# Altium project DO_AN2.PrjPCB
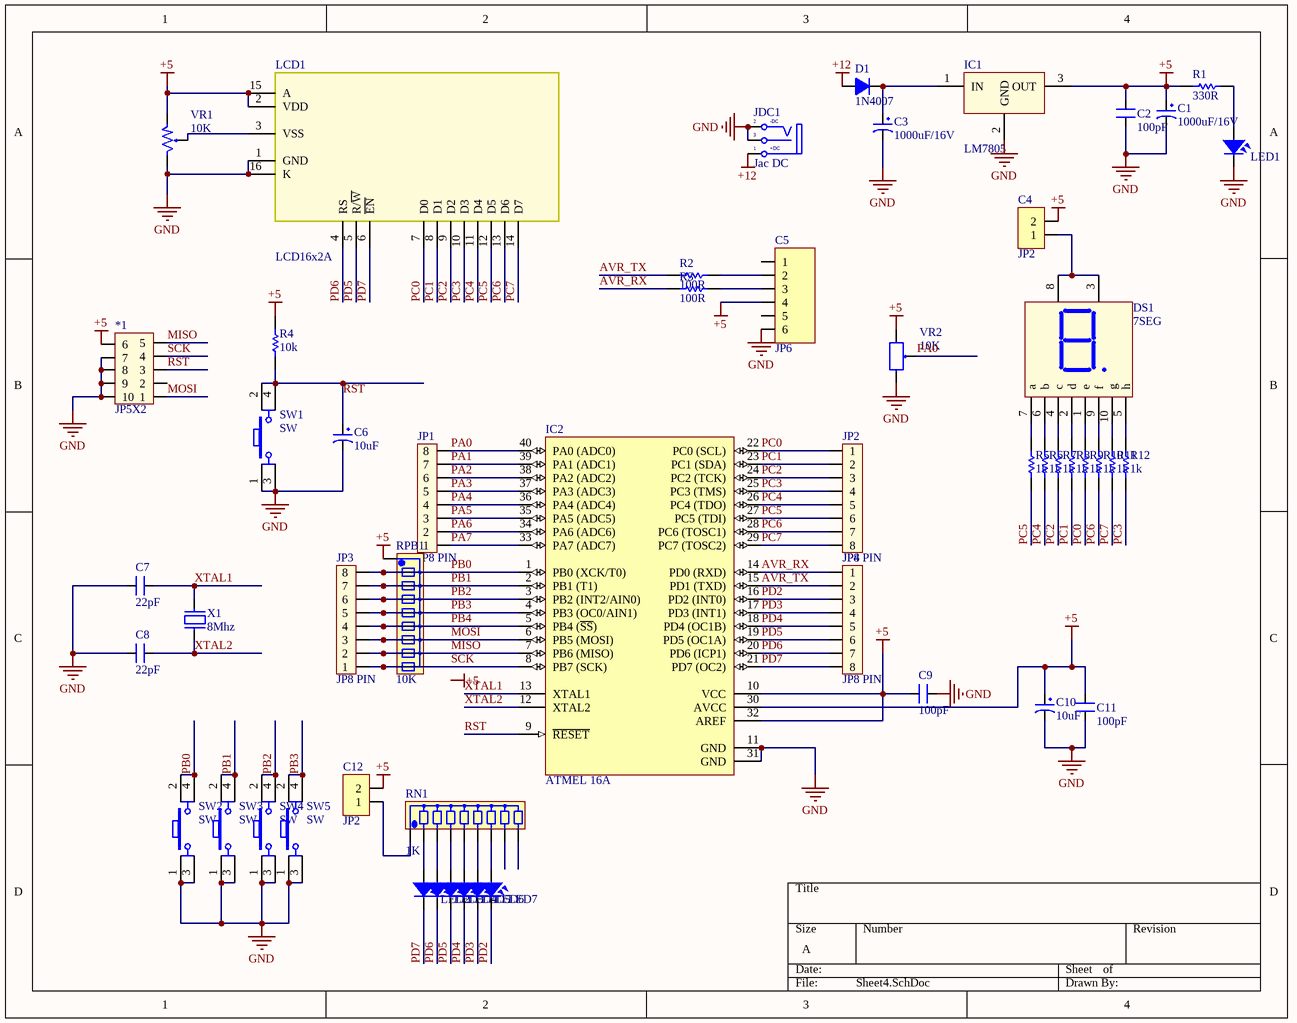
[diagram p0: Sheet4.SchDoc]
1 sheet, 52 parts. Net scope: global (net labels, ports and power ports of the same name join across sheets).
Board file: PCB5.PcbDoc

## Sheet Sheet4.SchDoc
size A

### Parts
*1  JP5X2  [JP5X2]
C1  1000uF/16V  [CP1.5/3.4]
C2  100pF  [CN1]
C3  1000uF/16V  [CP1.5/3.4]
C4  JP2  [JP2-D1T]
C5  JP6  [JP6-D1T]
C6  10uF  [CP1/2]
C7  22pF  [CN1]
C8  22pF  [CN1]
C9  100pF  [CN1]
C10  10uF  [CP1/2]
C11  100pF  [CN1]
C12  JP2  [JP2-D1T]
D1  1N4007  [D1A]
DS1  7SEG  [LED7SEG-1-0.56]
IC1  LM7805  [QTO-220]
IC2  ATMEL 16A  [DIP40/W0.6]
JDC1  Jac DC  [DC-IN]
JP1  JP8 PIN  [JP8]
JP2  JP8 PIN  [JP8]
JP3  JP8 PIN  [JP8]
JP4  JP8 PIN  [JP8]
LCD1  LCD16x2A  [LCD16X2]
LED1  LED  [LED-5-RED]  (value not drawn)
LED2  LED  [LED-3]  (value not drawn)
LED3  LED  [LED-3]  (value not drawn)
LED4  LED  [LED-3]  (value not drawn)
LED5  LED  [LED-3]  (value not drawn)
LED6  LED  [LED-3]  (value not drawn)
LED7  LED  [LED-3]  (value not drawn)
R1  value 330R  [R1/4W]  (hidden comment: Res1)
R2  value 100R  [R1/4W]  (hidden comment: Res1)
R3  value 100R  [R1/4W]  (hidden comment: Res1)
R4  value 10k  [R1/4W]  (hidden comment: Res1)
R5  value 1k  [R1/4W]  (hidden comment: Res1)
R6  value 1k  [R1/4W]  (hidden comment: Res1)
R7  value 1k  [R1/4W]  (hidden comment: Res1)
R8  value 1k  [R1/4W]  (hidden comment: Res1)
R9  value 1k  [R1/4W]  (hidden comment: Res1)
R10  value 1k  [R1/4W]  (hidden comment: Res1)
R11  value 1k  [R1/4W]  (hidden comment: Res1)
R12  value 1k  [R1/4W]  (hidden comment: Res1)
RN1  1K  [RN8]
RPB1  10K  [RN8]
SW1  SW  [SW4]
SW2  SW  [SW4]
SW3  SW  [SW4]
SW4  SW  [SW4]
SW5  SW  [SW4]
VR1  10K  [VR]
VR2  10K  [VR1]
X1  8Mhz  [XT2]

### Nets
+5: *1.6 C1.1 C2.1 C4.2 C5.4 C9.1 C10.1 C11.2 C12.2 IC1.3(OUT) IC2.10(VCC) IC2.30(AVCC) IC2.32(AREF) LCD1.2(VDD) LCD1.15(A) R1.2 R4.1 RPB1.1 VR1.1 VR2.1
+12: D1.1(A) JDC1.1(T)
GND: *1.7 *1.8 *1.9 *1.10 C1.2 C2.2 C3.2 C5.6 C6.2 C7.1 C8.1 C9.2 C10.2 C11.1 IC1.2(GND) IC2.11(GND) IC2.31(GND) JDC1.2(TN) JDC1.3(S) LCD1.1(GND) LCD1.16(K) LED1.2 SW1.1 SW1.3 SW2.1 SW2.3 SW3.1 SW3.3 SW4.1 SW4.3 SW5.1 SW5.3 VR1.3 VR2.3
AVR_RX: IC2.14(PD0_(RXD)) JP4.1 R3.2
AVR_TX: IC2.15(PD1_(TXD)) JP4.2 R2.2
MISO: *1.5 IC2.7(PB6_(MISO)) JP3.2 RPB1.8
MOSI: *1.1 IC2.6(PB5_(MOSI)) JP3.3 RPB1.7
PA0: IC2.40(PA0_(ADC0)) JP1.8 VR2.2
PA1: IC2.39(PA1_(ADC1)) JP1.7
PA2: IC2.38(PA2_(ADC2)) JP1.6
PA3: IC2.37(PA3_(ADC3)) JP1.5
PA4: IC2.36(PA4_(ADC4)) JP1.4
PA5: IC2.35(PA5_(ADC5)) JP1.3
PA6: IC2.34(PA6_(ADC6)) JP1.2
PA7: IC2.33(PA7_(ADC7)) JP1.1
PB0: IC2.1(PB0_(XCK/T0)) JP3.8 RPB1.2 SW2.2 SW2.4
PB1: IC2.2(PB1_(T1)) JP3.7 RPB1.3 SW3.2 SW3.4
PB2: IC2.3(PB2_(INT2/AIN0)) JP3.6 RPB1.4 SW4.2 SW4.4
PB3: IC2.4(PB3_(OC0/AIN1)) JP3.5 RPB1.5 SW5.2 SW5.4
PB4: IC2.5(PB4_(~{SS})) JP3.4 RPB1.6
PC0: IC2.22(PC0_(SCL)) JP2.1 LCD1.7(D0) R9.2
PC1: IC2.23(PC1_(SDA)) JP2.2 LCD1.8(D1) R8.2
PC2: IC2.24(PC2_(TCK)) JP2.3 LCD1.9(D2) R7.2
PC3: IC2.25(PC3_(TMS)) JP2.4 LCD1.10(D3) R12.2
PC4: IC2.26(PC4_(TDO)) JP2.5 LCD1.11(D4) R6.2
PC5: IC2.27(PC5_(TDI)) JP2.6 LCD1.12(D5) R5.2
PC6: IC2.28(PC6_(TOSC1)) JP2.7 LCD1.13(D6) R10.2
PC7: IC2.29(PC7_(TOSC2)) JP2.8 LCD1.14(D7) R11.2
PD2: IC2.16(PD2_(INT0)) JP4.3 LED7.2
PD3: IC2.17(PD3_(INT1)) JP4.4 LED6.2
PD4: IC2.18(PD4_(OC1B)) JP4.5 LED5.2
PD5: IC2.19(PD5_(OC1A)) JP4.6 LCD1.5(R/~{W}) LED4.2
PD6: IC2.20(PD6_(ICP1)) JP4.7 LCD1.4(RS) LED3.2
PD7: IC2.21(PD7_(OC2)) JP4.8 LCD1.6(~{EN}) LED2.2
RST: *1.3 C6.1 IC2.9(~{RESET}) R4.2 SW1.2 SW1.4
SCK: *1.4 IC2.8(PB7_(SCK)) JP3.1 RPB1.9
XTAL1: C7.2 IC2.13(XTAL1) X1.2
XTAL2: C8.2 IC2.12(XTAL2) X1.1
NetC3_1: C3.1 D1.2(K) IC1.1(IN)
NetC4_1: C4.1 DS1.3(Vcc) DS1.8(Vcc)
NetC5_2: C5.2 R2.1
NetC5_3: C5.3 R3.1
NetC12_1: C12.1 RN1.1
NetDS1_1: DS1.1(e) R9.1
NetDS1_2: DS1.2(d) R8.1
NetDS1_4: DS1.4(c) R7.1
NetDS1_5: DS1.5(h) R12.1
NetDS1_6: DS1.6(b) R6.1
NetDS1_7: DS1.7(a) R5.1
NetDS1_9: DS1.9(f) R10.1
NetDS1_10: DS1.10(g) R11.1
NetLCD1_3: LCD1.3(VSS) VR1.2
NetLED1_1: LED1.1 R1.1
NetLED2_1: LED2.1 RN1.2
NetLED3_1: LED3.1 RN1.3
NetLED4_1: LED4.1 RN1.4
NetLED5_1: LED5.1 RN1.5
NetLED6_1: LED6.1 RN1.6
NetLED7_1: LED7.1 RN1.7

Not connected (* = marked no-connect by the designer): *1 2; C5 1 5; RN1 8 9

### Notes on the sheet
- Labels drawn without touching a wire or pin: +5
- (in symbol DCIN) -DC; +DC

### Library data of the parts
C1 C3 = CP4: Cap 1000uF/16V - 220uF/50V; Description 5: 4,7uF>10uF/250V_3,3uF>10uF/400V - 2,2uF>4,7uF/450V; Description 1: 2200uF-3300uF/6,3V - 1000uF-2200uF/10V; Description 2: 1000uF/16V - 470uF => 1000uF/25V - 100uF/100V; Description 3: 330uF>470uF/35V_220uF>470uF/50V_10uF>22uF/250V; Description 4: 220uF => 330uF/63V - 10uF =>33uF/160 - 200V; Value: 1000uF/16V
C2 C9 C11 = CN1: Cap np  1pF - 472pF; Value: 100pF
C4 C12 = JP2: WR-PHD 2.54 mm Angled Socket Header; Manufacturer: W¨¹rth Elektronik eiSos GmbH; partNo: 613002143121; ComponentLink1 Description: Manufacturer; ComponentLink2 Description: Datasheet; NoPins: 02; Created Date: 29 March 2013; ComponentLink1URL: http://www.we-online.com; ComponentLink2URL: http://katalog.we-online.de/em/datasheet/6130xx143121.pdf; Created by: Karrer Zheng
C5 = JP6: WR-PHD 2.54 mm Angled Socket Header; Manufacturer: W¨¹rth Elektronik eiSos GmbH; partNo: 613006143121; ComponentLink1 Description: Manufacturer; ComponentLink2 Description: Datasheet; NoPins: 06; Created Date: 29 March 2013; ComponentLink1URL: http://www.we-online.com; ComponentLink2URL: http://katalog.we-online.de/em/datasheet/6130xx143121.pdf; Created by: Karrer Zheng
C6 C10 = CP1: Cap P  0,1uF < 22uF , 16 - 50V; Value: 10uF/50V; Description 1: 10 => 220uF/6,3V/10V - 10uF => 100uF/16V; Description 2: 0,1uF => 33uF/50V - 10uF => 22uF/63V; Description 3: 0,47uF => 10uF/100V
C7 C8 = CN1: Cap np  1pF - 472pF; Value: 100pF
D1 = D1A: Diode 1A; Value: 1N4007
DS1 = LED7SEG-1: 14.2 mm General Purpose Blue 7-Segment Display: CC, RH DP, Gray Surface; MinimumIntensity: 2020 ucd; Note: IF = 10 mA; Published: 8-Jun-2000; LatestRevisionDate: 17-Dec-2003; LatestRevisionNote: Schematic revised, PCB Footprint replaced.; DatasheetDocument: 24-Sep-2002; PackageDocument: 24-Sep-2002; PackageReference: H; Publisher: Altium Limited; Colour: Blue; ComponentLink1Description: Manufacturer Link; ComponentLink1URL: http://www.agilent.com/
IC1 = LM78xx: On ap +, from + 5 to + 24VDC; Value: LM7805
IC2 = ATmega16A-PU: 8-Bit AVR Microcontroller with 16K Bytes of In-System Programmable Flash Memory; Value: Atmega 16L
JDC1 = DCIN: Jac DC input; Value: Jac DC
JP1-JP4 = JP8: Value: JP7
LCD1 = LCD16x2: LCD dipslay 16 char, 2 line; Value: LCD16x2A
LED1-LED7 = LED: LED Single colour Green and Red; Value: LED 3 ly Single Colour
R1-R12 = Res1_1: Resistor; Manufacturer: Generic Components; Class: Passive; Published: 08/06/2000; Publisher: Altium Hobart Technology Centre; SubClass: Resistor
RN1 RPB1 = RN8: Resistor 8 (Thanh); Value: Tro thanh 10K
SW1-SW5 = SW4: Switch button 4 pin; Value: Button chip 4 pin
VR1 = VR1: Var Resistor; Value: VR 10K
VR2 = VR: Var Resistor; Value: VR 10K
X1 = XT2: Crystal For all Crystal 2pin.; Value: 4Mhz